# EAGLE schematic SX1262-NRFDK_Shield (EAGLE 9.7.0)
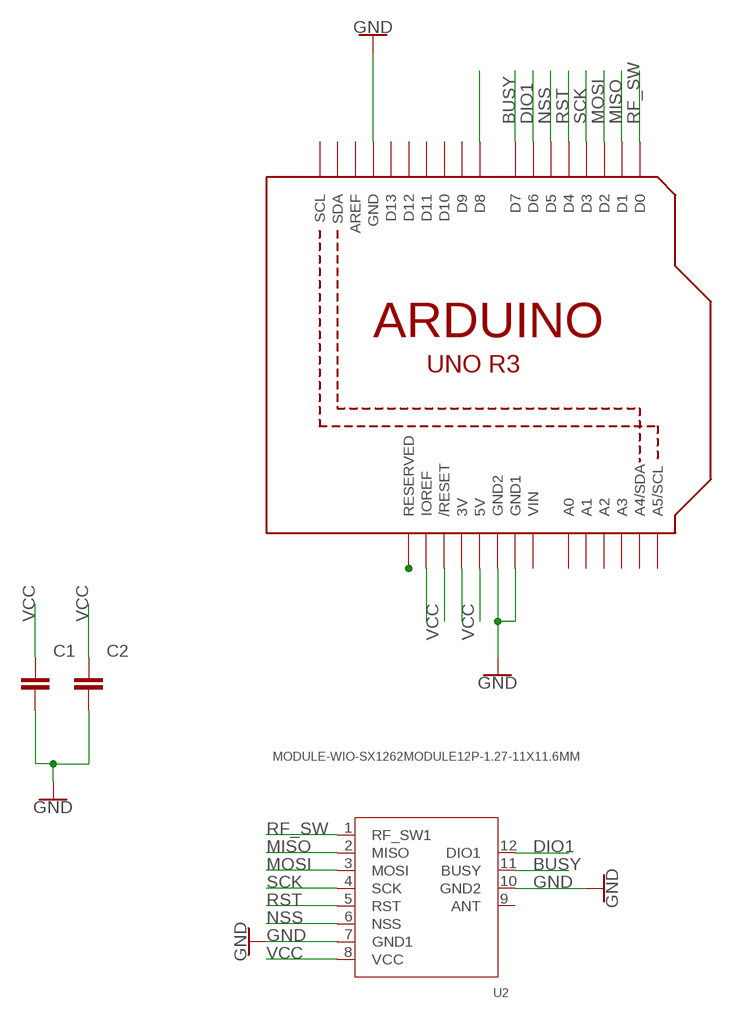
[diagram p0: schematic, sheet 1]

## Parts
C1  C_CHIP-0805(2012-METRIC)  [CAPC2012X110]
C2  C_CHIP-0805(2012-METRIC)  [CAPC2012X110]
U1  ARDUINOR3-BPLACE  [ARDUINOR3-BPLACE]
U2  MODULE-WIO-SX1262MODULE12P-1.27-11X11.6MM  [MODULE12P-1.27-11X11.6MM]

## Nets
BUSY: U1.D7 U2.11(BUSY)
DIO1: U1.D6 U2.12(DIO1)
GND: C1.2 C2.2 U1.GND U1.GND1 U1.GND2 U2.7(GND1) U2.10(GND2)
MISO: U1.D1 U2.2(MISO)
MOSI: U1.D2 U2.3(MOSI)
N$14: U1.RESET(/RESET)
N$16: U1.5V
N$31: U1.D8
NSS: U1.D5 U2.6(NSS)
RF_SW: U1.D0 U2.1(RF_SW1)
RST: U1.D4 U2.5(RST)
SCK: U1.D3 U2.4(SCK)
VCC: C1.1 C2.1 U1.3V U1.IOREF U1.RESERVED U2.8(VCC)
Unconnected: U1.A0 U1.A1 U1.A2 U1.A3 U1.A4(A4/SDA) U1.A5(A5/SCL) U1.AREF U1.D9 U1.D10 U1.D11 U1.D12 U1.D13 U1.SCL U1.SDA U2.9(ANT)

## Power pins joined to a net without a drawn wire
VIN: U1.VIN

## Library data of the parts
C1 C2 = Capacitor:C: Capacitor - Generic; CATEGORY: Capacitor
U1 = NRFDK SHIELD:ARDUINOR3: This is a new object for the new Arduino R3 - with extra pins that you may want to use (such as IOref, and duplicated A4/A5
U2 = Wio-SX1262 Schematic Package:MODULE-WIO-SX1262